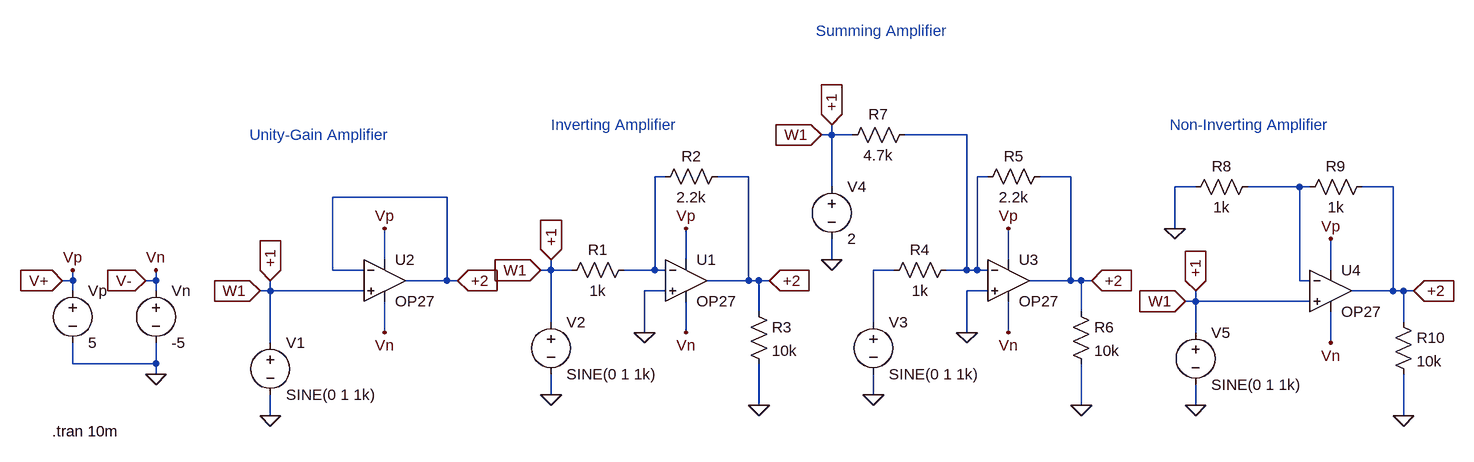
[diagram p0: schematic opamp_ltspice.asc]
opamp_ltspice.asc, the LTspice schematic file:
Version 4
SHEET 1 1800 680
WIRE 816 -64 816 -80
WIRE 816 -64 800 -64
WIRE 848 -64 816 -64
WIRE 1024 -64 928 -64
WIRE 560 0 544 0
WIRE 688 0 640 0
WIRE 1056 0 1040 0
WIRE 1184 0 1136 0
WIRE 816 16 816 -64
WIRE 1376 16 1344 16
WIRE 1536 16 1456 16
WIRE 1552 16 1536 16
WIRE 1680 16 1632 16
WIRE 224 32 48 32
WIRE 1344 80 1344 16
WIRE 128 128 128 80
WIRE 592 128 592 80
WIRE 816 128 816 96
WIRE 1088 128 1088 80
WIRE 48 144 48 32
WIRE 96 144 48 144
WIRE 384 144 384 128
WIRE 384 144 368 144
WIRE 416 144 384 144
WIRE 544 144 544 0
WIRE 544 144 496 144
WIRE 560 144 544 144
WIRE 912 144 880 144
WIRE 1024 144 1024 -64
WIRE 1024 144 992 144
WIRE 1040 144 1040 0
WIRE 1040 144 1024 144
WIRE 1056 144 1040 144
WIRE 1584 144 1584 96
WIRE -352 160 -352 144
WIRE -352 160 -368 160
WIRE -224 160 -224 144
WIRE -224 160 -240 160
WIRE 224 160 224 32
WIRE 224 160 160 160
WIRE 240 160 224 160
WIRE 688 160 688 0
WIRE 688 160 624 160
WIRE 704 160 688 160
WIRE 720 160 704 160
WIRE 1184 160 1184 0
WIRE 1184 160 1120 160
WIRE 1200 160 1184 160
WIRE 1216 160 1200 160
WIRE 1536 160 1536 16
WIRE 1552 160 1536 160
WIRE -352 176 -352 160
WIRE -224 176 -224 160
WIRE -48 176 -48 160
WIRE -48 176 -64 176
WIRE 96 176 -48 176
WIRE 560 176 528 176
WIRE 1056 176 1024 176
WIRE 1680 176 1680 16
WIRE 1680 176 1616 176
WIRE 1696 176 1680 176
WIRE 1712 176 1696 176
WIRE 1376 192 1376 176
WIRE 1376 192 1360 192
WIRE 1552 192 1376 192
WIRE 704 208 704 160
WIRE 1200 208 1200 160
WIRE 384 224 384 144
WIRE 880 224 880 144
WIRE 1696 224 1696 176
WIRE 128 240 128 192
WIRE 528 240 528 176
WIRE 592 240 592 192
WIRE 1024 240 1024 176
WIRE 1088 240 1088 192
WIRE 1376 240 1376 192
WIRE -48 256 -48 176
WIRE 1584 256 1584 208
WIRE -352 288 -352 256
WIRE -224 288 -224 256
WIRE -224 288 -352 288
WIRE -224 304 -224 288
WIRE 384 336 384 304
WIRE 880 336 880 304
WIRE 704 352 704 288
WIRE 1200 352 1200 288
WIRE 1376 352 1376 320
WIRE -48 368 -48 336
WIRE 1696 368 1696 304
FLAG -48 368 0
FLAG -224 304 0
FLAG -352 144 Vp
FLAG -224 144 Vn
FLAG 128 240 Vn
FLAG 128 80 Vp
FLAG 384 336 0
FLAG 592 240 Vn
FLAG 592 80 Vp
FLAG 704 352 0
FLAG 528 240 0
FLAG 880 336 0
FLAG 1088 240 Vn
FLAG 1088 80 Vp
FLAG 1200 352 0
FLAG 1024 240 0
FLAG 816 128 0
FLAG 1376 352 0
FLAG 1584 256 Vn
FLAG 1584 96 Vp
FLAG 1696 368 0
FLAG 1344 80 0
FLAG -64 176 W1
IOPIN -64 176 In
FLAG -48 160 +1
IOPIN -48 160 In
FLAG 240 160 +2
IOPIN 240 160 In
FLAG 368 144 W1
IOPIN 368 144 In
FLAG 384 128 +1
IOPIN 384 128 In
FLAG 720 160 +2
IOPIN 720 160 In
FLAG -368 160 V+
IOPIN -368 160 In
FLAG -240 160 V-
IOPIN -240 160 In
FLAG 800 -64 W1
IOPIN 800 -64 In
FLAG 816 -80 +1
IOPIN 816 -80 In
FLAG 1216 160 +2
IOPIN 1216 160 In
FLAG 1360 192 W1
IOPIN 1360 192 In
FLAG 1376 176 +1
IOPIN 1376 176 In
FLAG 1712 176 +2
IOPIN 1712 176 In
SYMBOL voltage -48 240 R0
WINDOW 123 0 0 Left 0
WINDOW 39 0 0 Left 0
SYMATTR InstName V1
SYMATTR Value SINE(0 1 1k)
SYMBOL voltage -352 160 R0
WINDOW 123 0 0 Left 0
WINDOW 39 0 0 Left 0
SYMATTR InstName Vp
SYMATTR Value 5
SYMBOL voltage -224 160 R0
WINDOW 123 0 0 Left 0
WINDOW 39 0 0 Left 0
SYMATTR InstName Vn
SYMATTR Value -5
SYMBOL voltage 384 208 R0
WINDOW 123 0 0 Left 0
WINDOW 39 0 0 Left 0
SYMATTR InstName V2
SYMATTR Value SINE(0 1 1k)
SYMBOL res 512 128 R90
WINDOW 0 0 56 VBottom 2
WINDOW 3 32 56 VTop 2
SYMATTR InstName R1
SYMATTR Value 1k
SYMBOL res 656 -16 R90
WINDOW 0 0 56 VBottom 2
WINDOW 3 32 56 VTop 2
SYMATTR InstName R2
SYMATTR Value 2.2k
SYMBOL res 688 192 R0
SYMATTR InstName R3
SYMATTR Value 10k
SYMBOL Opamps\\OP27 128 96 R0
SYMATTR InstName U2
SYMBOL voltage 880 208 R0
WINDOW 123 0 0 Left 0
WINDOW 39 0 0 Left 0
SYMATTR InstName V3
SYMATTR Value SINE(0 1 1k)
SYMBOL res 1008 128 R90
WINDOW 0 0 56 VBottom 2
WINDOW 3 32 56 VTop 2
SYMATTR InstName R4
SYMATTR Value 1k
SYMBOL res 1152 -16 R90
WINDOW 0 0 56 VBottom 2
WINDOW 3 32 56 VTop 2
SYMATTR InstName R5
SYMATTR Value 2.2k
SYMBOL res 1184 192 R0
SYMATTR InstName R6
SYMATTR Value 10k
SYMBOL voltage 816 0 R0
WINDOW 123 0 0 Left 0
WINDOW 39 0 0 Left 0
SYMATTR InstName V4
SYMATTR Value 2
SYMBOL res 944 -80 R90
WINDOW 0 0 56 VBottom 2
WINDOW 3 32 56 VTop 2
SYMATTR InstName R7
SYMATTR Value 4.7k
SYMBOL voltage 1376 224 R0
WINDOW 123 0 0 Left 0
WINDOW 39 0 0 Left 0
SYMATTR InstName V5
SYMATTR Value SINE(0 1 1k)
SYMBOL res 1648 0 R90
WINDOW 0 0 56 VBottom 2
WINDOW 3 32 56 VTop 2
SYMATTR InstName R9
SYMATTR Value 1k
SYMBOL res 1680 208 R0
SYMATTR InstName R10
SYMATTR Value 10k
SYMBOL res 1472 0 R90
WINDOW 0 0 56 VBottom 2
WINDOW 3 32 56 VTop 2
SYMATTR InstName R8
SYMATTR Value 1k
SYMBOL Opamps\\OP27 592 96 R0
SYMATTR InstName U1
SYMBOL Opamps\\OP27 1088 96 R0
SYMATTR InstName U3
SYMBOL Opamps\\OP27 1584 112 R0
SYMATTR InstName U4
TEXT -384 392 Left 2 !.tran 10m
TEXT -80 -64 Left 2 ;Unity-Gain Amplifier
TEXT 384 -80 Left 2 ;Inverting Amplifier
TEXT 792 -224 Left 2 ;Summing Amplifier
TEXT 1336 -80 Left 2 ;Non-Inverting Amplifier

The netlist it stands for:
* opamp_ltspice.asc
V1 +1 0 SINE(0 1 1k)
Vp V+ 0 5
Vn V- 0 -5
V2 +1 0 SINE(0 1 1k)
R1 N002 +1 1k
R2 +2 N002 2.2k
R3 +2 0 10k
XU2 +1 +2 V+ V- +2 OP27  ; pins In+ In- V+ V- OUT
V3 N004 0 SINE(0 1 1k)
R4 N001 N004 1k
R5 +2 N001 2.2k
R6 +2 0 10k
V4 +1 0 2
R7 N001 +1 4.7k
V5 +1 0 SINE(0 1 1k)
R9 +2 N003 1k
R10 +2 0 10k
R8 N003 0 1k
XU1 0 N002 V+ V- +2 OP27  ; pins In+ In- V+ V- OUT
XU3 0 N001 V+ V- +2 OP27  ; pins In+ In- V+ V- OUT
XU4 +1 N003 V+ V- +2 OP27  ; pins In+ In- V+ V- OUT
.tran 10m
* Unity-Gain Amplifier
* Inverting Amplifier
* Summing Amplifier
* Non-Inverting Amplifier
.lib ADI.lib
.backanno
.end